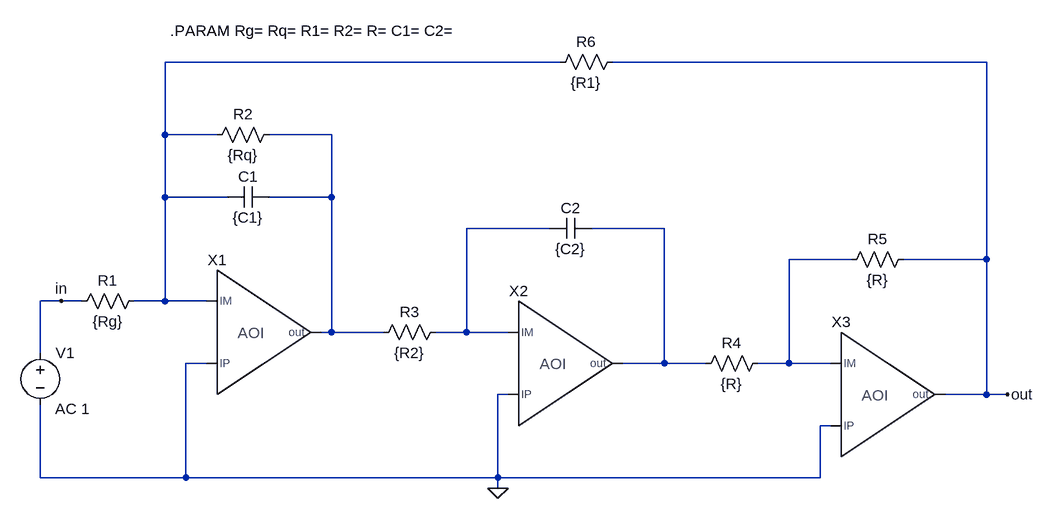
[diagram p0: schematic test_biquad_ideal.asc]
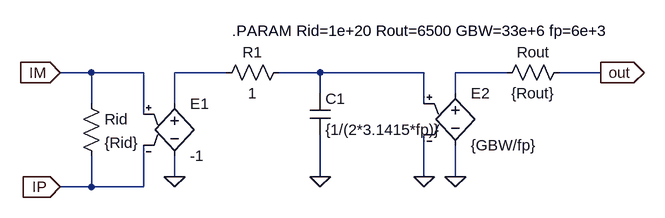
[diagram p1: sub-circuit ao_model.asc]
test_biquad_ideal.asc, the LTspice schematic file:
Version 4
SHEET 1 2136 816
WIRE 1104 16 496 16
WIRE 1760 16 1184 16
WIRE 496 128 496 16
WIRE 576 128 496 128
WIRE 752 128 656 128
WIRE 496 224 496 128
WIRE 592 224 496 224
WIRE 752 224 752 128
WIRE 752 224 656 224
WIRE 1088 272 960 272
WIRE 1264 272 1152 272
WIRE 1552 320 1456 320
WIRE 1760 320 1760 16
WIRE 1760 320 1632 320
WIRE 336 384 304 384
WIRE 368 384 336 384
WIRE 496 384 496 224
WIRE 496 384 448 384
WIRE 560 384 496 384
WIRE 752 432 752 224
WIRE 752 432 736 432
WIRE 832 432 752 432
WIRE 960 432 960 272
WIRE 960 432 912 432
WIRE 1024 432 960 432
WIRE 304 464 304 384
WIRE 560 480 528 480
WIRE 1264 480 1264 272
WIRE 1264 480 1200 480
WIRE 1328 480 1264 480
WIRE 1456 480 1456 320
WIRE 1456 480 1408 480
WIRE 1520 480 1456 480
WIRE 1024 528 1008 528
WIRE 1760 528 1760 320
WIRE 1760 528 1696 528
WIRE 1792 528 1760 528
WIRE 1520 576 1504 576
WIRE 304 656 304 544
WIRE 528 656 528 480
WIRE 528 656 304 656
WIRE 1008 656 1008 528
WIRE 1008 656 528 656
WIRE 1504 656 1504 576
WIRE 1504 656 1008 656
WIRE 1008 672 1008 656
FLAG 1792 528 out
FLAG 336 384 in
FLAG 1008 672 0
SYMBOL cap 656 208 R90
WINDOW 0 0 32 VBottom 2
WINDOW 3 32 32 VTop 2
SYMATTR InstName C1
SYMATTR Value {C1}
SYMBOL voltage 304 448 R0
WINDOW 3 29 109 Left 2
WINDOW 123 23 102 Left 2
WINDOW 39 0 0 Left 2
SYMATTR Value ""
SYMATTR Value2 AC 1
SYMATTR InstName V1
SYMBOL res 464 368 R90
WINDOW 0 0 56 VBottom 2
WINDOW 3 32 56 VTop 2
SYMATTR InstName R1
SYMATTR Value {Rg}
SYMBOL ao_model 608 432 R0
SYMATTR InstName X1
SYMBOL res 672 112 R90
WINDOW 0 0 56 VBottom 2
WINDOW 3 32 56 VTop 2
SYMATTR InstName R2
SYMATTR Value {Rq}
SYMBOL cap 1152 256 R90
WINDOW 0 0 32 VBottom 2
WINDOW 3 32 32 VTop 2
SYMATTR InstName C2
SYMATTR Value {C2}
SYMBOL ao_model 1072 480 R0
SYMATTR InstName X2
SYMBOL res 928 416 R90
WINDOW 0 0 56 VBottom 2
WINDOW 3 32 56 VTop 2
SYMATTR InstName R3
SYMATTR Value {R2}
SYMBOL ao_model 1568 528 R0
SYMATTR InstName X3
SYMBOL res 1424 464 R90
WINDOW 0 0 56 VBottom 2
WINDOW 3 32 56 VTop 2
SYMATTR InstName R4
SYMATTR Value {R}
SYMBOL res 1648 304 R90
WINDOW 0 0 56 VBottom 2
WINDOW 3 32 56 VTop 2
SYMATTR InstName R5
SYMATTR Value {R}
SYMBOL res 1200 0 R90
WINDOW 0 0 56 VBottom 2
WINDOW 3 32 56 VTop 2
SYMATTR InstName R6
SYMATTR Value {R1}
TEXT 504 -32 Left 2 !.PARAM Rg= Rq= R1= R2= R= C1= C2=

ao_model.asc, the sub-circuit schematic file:
Version 4
SHEET 1 880 852
WIRE -80 352 -128 352
WIRE 0 352 -80 352
WIRE 128 352 48 352
WIRE 272 352 208 352
WIRE 432 352 272 352
WIRE 560 352 480 352
WIRE 704 352 640 352
WIRE 272 384 272 352
WIRE 480 384 480 352
WIRE -80 400 -80 352
WIRE 48 400 48 352
WIRE 432 400 432 352
WIRE 0 416 0 352
WIRE 48 512 48 480
WIRE 272 512 272 448
WIRE 432 512 432 448
WIRE 480 512 480 464
WIRE -80 528 -80 480
WIRE -80 528 -128 528
WIRE 0 528 0 464
WIRE 0 528 -80 528
FLAG -128 352 IM
IOPIN -128 352 In
FLAG -128 528 IP
IOPIN -128 528 In
FLAG 48 512 0
FLAG 272 512 0
FLAG 432 512 0
FLAG 480 512 0
FLAG 704 352 out
IOPIN 704 352 Out
SYMBOL e 48 384 R0
SYMATTR InstName E1
SYMATTR Value -1
SYMBOL res 224 336 R90
WINDOW 0 0 56 VBottom 2
WINDOW 3 32 56 VTop 2
SYMATTR InstName R1
SYMATTR Value 1
SYMBOL res -96 384 R0
SYMATTR InstName Rid
SYMATTR Value {Rid}
SYMBOL cap 256 384 R0
SYMATTR InstName C1
SYMATTR Value {1/(2*3.1415*fp)}
SYMBOL e 480 368 R0
SYMATTR InstName E2
SYMATTR Value {GBW/fp}
SYMBOL res 656 336 R90
WINDOW 0 0 56 VBottom 2
WINDOW 3 32 56 VTop 2
SYMATTR InstName Rout
SYMATTR Value {Rout}
TEXT 136 288 Left 2 !.PARAM Rid=1e+20 Rout=6500 GBW=33e+6 fp=6e+3

The netlist it stands for:
* test_biquad_ideal.asc
C1 N002 N001 {C1}
V1 in 0 AC 1
R1 N001 in {Rg}
XX1 N001 0 N002 ao_model
R2 N002 N001 {Rq}
C2 N004 N003 {C2}
XX2 N003 0 N004 ao_model
R3 N003 N002 {R2}
XX3 N005 0 out ao_model
R4 N005 N004 {R}
R5 out N005 {R}
R6 out N001 {R1}

* block symbol definitions
.subckt ao_model IM IP out
E1 N001 0 IM IP -1
R1 N002 N001 1
Rid IM IP {Rid}
C1 N002 0 {1/(2*3.1415*fp)}
E2 N003 0 N002 0 {GBW/fp}
Rout out N003 {Rout}
.PARAM Rid=1e+20 Rout=6500 GBW=33e+6 fp=6e+3
.ends ao_model

.PARAM Rg= Rq= R1= R2= R= C1= C2=
.backanno
.end